# EAGLE schematic NeopixelExtension (EAGLE 7.2.0)
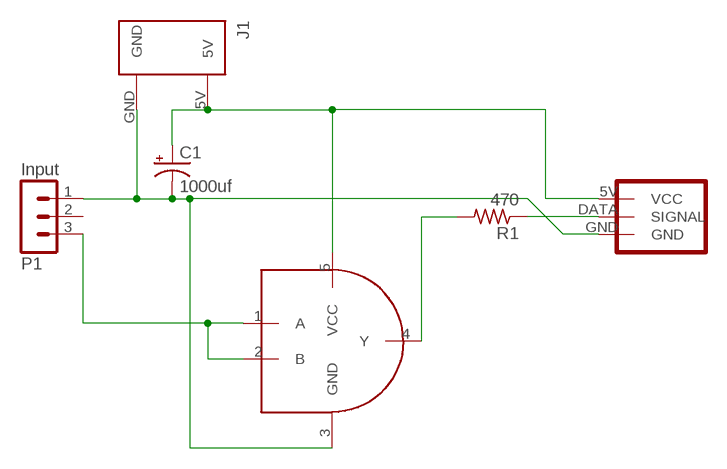
[diagram p0: schematic, sheet 1]

## Parts
C1  1000uf  CPOL-USE5-10.5  [E5-10,5]
J1  POWER  [POWER]
P1  Input  MA03-1  [MA03-1]
R1  470  R-US_R1206  [R1206]
U1  74AHCT1G08  [SOT25]
U$2  NEOPIXEL1  [NEODIRECTSOLDERORMA03-1]

## Nets
GND: C1.- J1.GND P1.1 U1.3(GND) U$2.GND
N$1: R1.1 U$2.DATA(SIGNAL)
N$2: P1.3 U1.1(A) U1.2(B)
N$4: R1.2 U1.4(Y)
VCC: C1.+ J1.5V U1.5(VCC) U$2.5V(VCC)
Unconnected: P1.2

## Library data of the parts
C1 = adafruit:CPOL-US: POLARIZED CAPACITOR, American symbol
J1 = Molex-39543-0002:POWER
P1 = con-lstb-modified:MA03-1: PIN HEADER; OC_FARNELL: unknown; OC_NEWARK: unknown
R1 = resistor:R-US_: RESISTOR, American symbol
U1 = SOT25:74AHCT1G08
U$2 = NeopixelConnector:NEOPIXEL1